# Altium project gateway.PrjPcb
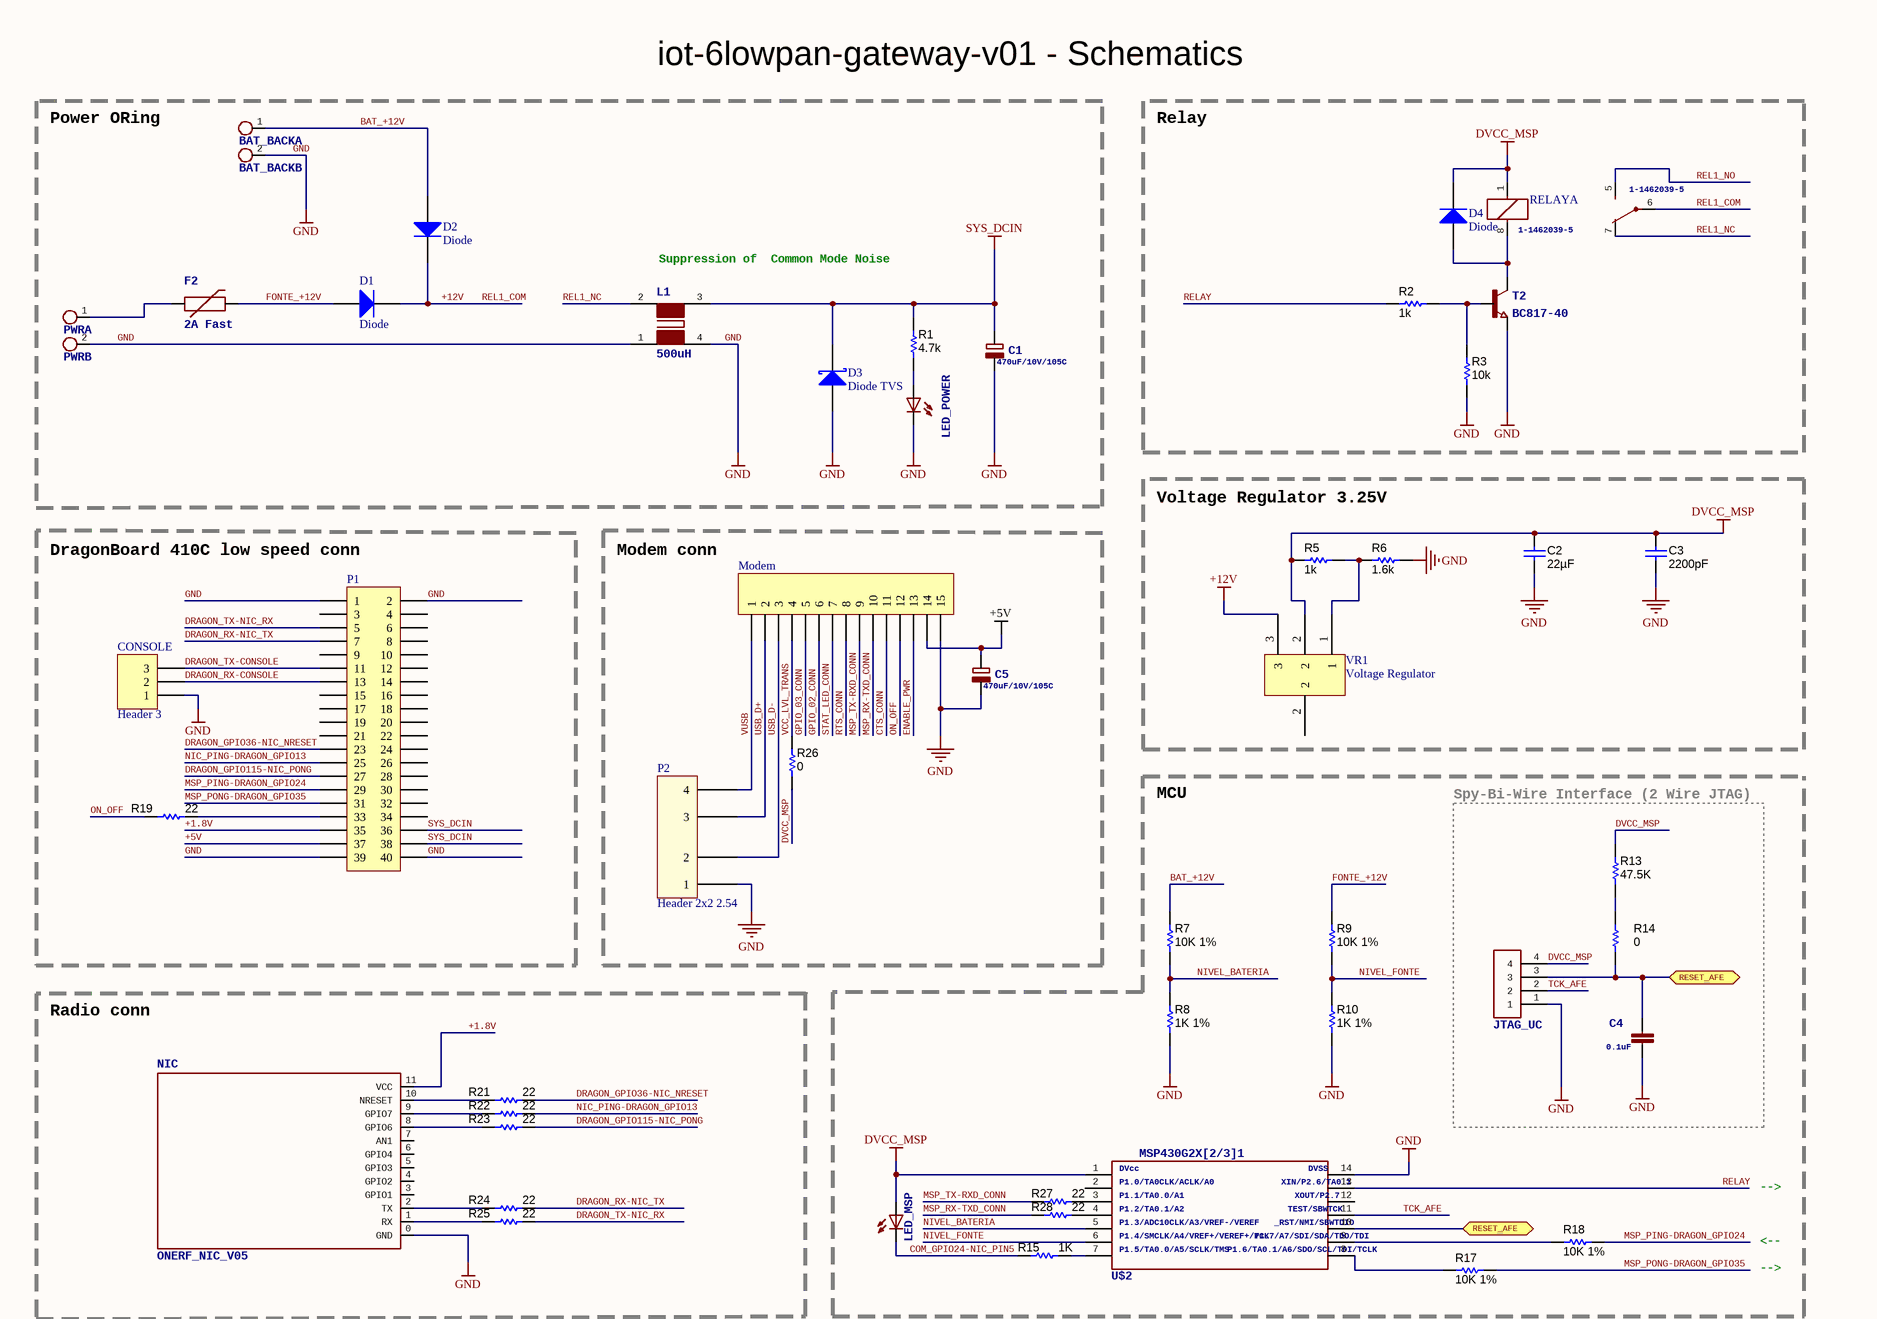
[diagram p0: gateway.SchDoc, top]
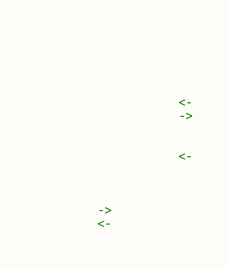
[diagram p1: gateway.SchDoc, bottom]
1 sheet, 48 parts. Net scope: flat (ports and power ports of the same name join across sheets).
Board file: gateway.PcbDoc

## Sheet gateway.SchDoc: oneRF_Base_COM_v04
size A3; Date: 2017-06-13 2:38:07 PM; SheetNumber: 1; PageSetup: Record=PageOptions|CenterHorizontal=True|CenterVertical=True|PrintScale=0.70|XCorrection=1.00|YCorrection=1.00|PrintKind=2|BorderSize=5000000|LeftOffset=0|BottomOffset=0|Orientation=2|PaperLength=1000|PaperWidth=1000|Scale=100|PaperSource=7|PrintQuality=-3|MediaType=1|DitherType=10|PrintScaleMode=0|PaperKind=A4|PaperIndex=9

### Parts
BAT_BACK  MKDSN1,5/2-5,08  [MKDSN1,5/2-5,08]  (value not drawn)  (parts A,B of 2)
C1  470uF/10V/105C  [E2,5-6,3]
C2  ValueDisplayed: 22µF  [0805_HV]  (hidden comment: C2012X5R1C226K125AC)
C3  ValueDisplayed: 2200pF  [0603]  (hidden comment: CL10B222KB8SFNC)
C4  0.1uF  [0603]
C5  470uF/10V/105C  [E2,5-6,3]
CONSOLE  Header 3  [HDR1X3]
D1  Diode  [SOD-80]
D2  Diode  [SOD-80]
D3  Diode TVS  [SMB]
D4  Diode  [SOD-80]
F2  2A Fast  [C1206]
JTAG_UC  CONECTOR_1X042.54MM  [HDR1X4]  (value not drawn)
L1  500uH  [WE-SL2_74422...]
LED_MSP  LED/WHITE/0603  [LED0603]  (value not drawn)
LED_POWER  LED/Red/0603  [LED0603]  (value not drawn)
Modem  oneRF_Modem_v01  [oneRF_Modem_v01]  (value not drawn)
NIC  ONERF_NIC_V05  [ONERF_NIC_V05]
P1  Header 20X2  [HDR2X20]  (value not drawn)
P2  Header 2x2 2.54  [HEADER2x2(2.54)]
PWR  MKDSN1,5/2-5,08  [MKDSN1,5/2-5,08]  (value not drawn)  (parts A,B of 2)
R1  value 4.7k  [0603]  (hidden comment: CRCW06031K00FKEA)
R2  value 1k  [0603]  (hidden comment: CRCW06031K00FKEA)
R3  value 10k  [0603]  (hidden comment: CRCW06031K00FKEA)
R5  value 1k  [0603]  (hidden comment: CRCW06031K00FKEA)
R6  value 1.6k  [0603]  (hidden comment: RC0603FR-071K6L)
R7  value 10K 1%  [0603]  (hidden comment: CRCW06031K00FKEA)
R8  value 1K 1%  [0603]  (hidden comment: CRCW06031K00FKEA)
R9  value 10K 1%  [0603]  (hidden comment: CRCW06031K00FKEA)
R10  value 1K 1%  [0603]  (hidden comment: CRCW06031K00FKEA)
R13  value 47.5K  [0603]  (hidden comment: CRCW06031K00FKEA)
R14  value 0  [0603]  (hidden comment: CRCW06031K00FKEA)
R15  value 1K  [0603]  (hidden comment: CRCW06031K00FKEA)
R17  value 10K 1%  [0603]  (hidden comment: CRCW06031K00FKEA)
R18  value 10K 1%  [0603]  (hidden comment: CRCW06031K00FKEA)
R19  value 22  [0603]  (hidden comment: CRCW06031K00FKEA)
R21  value 22  [0603]  (hidden comment: CRCW06031K00FKEA)
R22  value 22  [0603]  (hidden comment: CRCW06031K00FKEA)
R23  value 22  [0603]  (hidden comment: CRCW06031K00FKEA)
R24  value 22  [0603]  (hidden comment: CRCW06031K00FKEA)
R25  value 22  [0603]  (hidden comment: CRCW06031K00FKEA)
R26  value 0  [0603]  (hidden comment: CRCW06031K00FKEA)
R27  value 22  [0603]  (hidden comment: CRCW06031K00FKEA)
R28  value 22  [0603]  (hidden comment: CRCW06031K00FKEA)
RELAY  1-1462039-5  [1-1462039-5]  (parts A,B of 2)
T2  BC817-40  [SOT23_N]
U$2  MSP430G2231  [PW014_N]  (value not drawn)
VR1  Voltage Regulator  [SOT223]

### Blocks framed on the sheet
Power ORing: BAT_BACK C1 D1-D3 F2 L1 LED_POWER PWR R1
Relay: D4 R2 R3 RELAY T2
Voltage Regulator 3.25V: C2 C3 R5 R6 VR1
DragonBoard 410C low speed conn: CONSOLE P1 R19
Modem conn: C5 Modem P2 R26
MCU: LED_MSP R7-R10 R15 R17 R18 R27 R28 U$2
Spy-Bi-Wire Interface (2 Wire JTAG): C4 JTAG_UC R13 R14
Radio conn: NIC R21-R25

### Ports
RESET_AFE

### Nets
+5V: C5.+ Modem.14 P1.37
+12V: D1.2(K) D2.2(K) RELAY.6(COM) VR1.3  [also labelled REL1_COM]
DVCC_MSP: C2.1 C3.2 D4.2(K) JTAG_UC.4 LED_MSP.1(A) R5.1 R13.2 R26.1 RELAY.1 U$2.1 VR1.2
GND: BAT_BACK.2(KL) C1.- C2.2 C3.1 C4.2 C5.- CONSOLE.1 D3.1(A) JTAG_UC.1 L1.1 L1.4 LED_POWER.2(C) Modem.15 NIC.0(GND) P1.1 P1.2 P1.39 P1.40 P2.1 PWR.2(KL) R3.1 R6.2 R8.1 R10.1 T2.2(E) U$2.14
SYS_DCIN: C1.+ D3.2(K) L1.3 P1.36 P1.38 R1.2
+1.8V: NIC.11(VCC) P1.35
BAT_+12V: BAT_BACK.1(KL) D2.1(A) R7.2
COM_GPIO24-NIC_PIN5: LED_MSP.2(C) R15.2
CTS_CONN: Modem.11
DRAGON_GPIO36-NIC_NRESET: P1.23 R21.1
DRAGON_GPIO115-NIC_PONG: P1.27 R23.1
DRAGON_RX-CONSOLE: CONSOLE.2 P1.13
DRAGON_RX-NIC_TX: P1.7 R24.1
DRAGON_TX-CONSOLE: CONSOLE.3 P1.11
DRAGON_TX-NIC_RX: P1.5 R25.1
ENABLE_PWR: Modem.13
FONTE_+12V: D1.1(A) F2.2 R9.2
GPIO_02_CONN: Modem.6
GPIO_03_CONN: Modem.5
MSP_PING-DRAGON_GPIO24: P1.29 R18.1
MSP_PONG-DRAGON_GPIO35: P1.31 R17.1
MSP_RX-TXD_CONN: Modem.10 R28.2
MSP_TX-RXD_CONN: Modem.9 R27.2
NIC_PING-DRAGON_GPIO13: P1.25 R22.1
NIVEL_BATERIA: R7.1 R8.2 U$2.5
NIVEL_FONTE: R9.1 R10.2 U$2.6
ON_OFF: Modem.12 R19.2
REL1_NC: L1.2 RELAY.7(NC)
REL1_NO: RELAY.5(NO)
RELAY: R2.2 U$2.13
RTS_CONN: Modem.8
STAT_LED_CONN: Modem.7
TCK_AFE: JTAG_UC.2 U$2.11
USB_D+: Modem.2 P2.3
USB_D-: Modem.3 P2.2
VCC_LVL_TRANS: Modem.4 R26.2
VUSB: Modem.1 P2.4
NetC4_1: C4.1 JTAG_UC.3 R14.1 U$2.10 ; port RESET_AFE
NetD4_1: D4.1(A) RELAY.8 T2.3(C)
NetF2_1: F2.1 PWR.1(KL)
NetLED_POWER_1: LED_POWER.1(A) R1.1
NetNIC_1: NIC.1(RX) R25.2
NetNIC_2: NIC.2(TX) R24.2
NetNIC_8: NIC.8(GPIO6) R23.2
NetNIC_9: NIC.9(GPIO7) R22.2
NetNIC_10: NIC.10(NRESET) R21.2
NetP1_33: P1.33 R19.1
NetR2_1: R2.1 R3.2 T2.1(B)
NetR5_2: R5.2 R6.1 VR1.1
NetR13_1: R13.1 R14.2
NetR15_1: R15.1 U$2.7
NetR17_2: R17.2 U$2.8
NetR18_2: R18.2 U$2.9
NetR27_1: R27.1 U$2.3
NetR28_1: R28.1 U$2.4

Not connected (* = marked no-connect by the designer): NIC 3(GPIO1) 4(GPIO2) 5(GPIO3) 6(GPIO4) 7(AN1); P1 3 4 6 8 9 10 12 14 15 16 17 18 19 20 21 22 24 26 28 30 32 34; U$2 2 12

### Notes on the sheet
- iot-6lowpan-gateway-v01 - Schematics
- (near L1) Suppression of
  Common Mode Noise
- -->
- <--
- <-
- ->

### Library data of the parts
BAT_BACK PWR = MKDSN1,5/2-5,08: MKDSN 1,5/ 2-5,08 Printklemme   Nennstrom: 13,5 A Nennspannung: 250 V Rastermaß: 5,08 mm Polzahl: 2 Anschlussart: Schraubanschluss Montage: Löten Anschlussrichtung Leiter/Platine: 0 ° Artikelnummer: 1729128 Source: http://eshop.phoenixcontact.com .. 1729128.pdf; DIGIKEY: ED2768-ND
C1 C5 = CPOL-EUE2.5-6.3: POLARIZED CAPACITOR, European symbol
C2 = C2012X5R1C226K125AC: CAP, CERM, 22 µF, 16 V, +/- 10%, X5R, 0805; Value: 22uF; Tolerance_%: 10; VDC_V: 16; Value2: 16V; TaMin_C: -55; TaMax_C: 85; PartNumber: C2012X5R1C226K125AC; Technology: Ceramic; TempCo: X5R
C3 = C1005X7R1H222K: CAP, CERM, 2200 pF, 50 V, +/- 10%, X7R, 0603; Polarized: N; CompType: Capacitor; Value: 2200pF; U/M: EA; Tolerance_%: 10; VDC_V: 50; Value2: 50V; TaMin_C: -55; TaMax_C: 125; SymbolVersion: 2008-07-09; PartNumber: CL10B222KB8SFNC; PackageReference: 0603; RoHS: Y; MountType: SMT; Technology: Ceramic; TempCo: X7R; Cap_Case: 0603; Published: 2008-06-19; Publisher: Texas Instruments; Supplier 1: Digi-Key
C4 = C-EUC0603_DWS: CAPACITOR, European symbol
CONSOLE = Header 3: Header, 3-Pin; LatestRevisionDate: 17-Jul-2002; LatestRevisionNote: Re-released for DXP Platform.; Publisher: Altium Limited
D1 D2 D4 = Diode: Diode, 100v, 1V, 200mA, -65º, 175º, SMT; PartNumber: FDLL4148_D87Z
D3 = D Schottky: Schottky Diode; Published: 8-Jun-2000; LatestRevisionDate: 17-Jul-2002; LatestRevisionNote: Re-released for DXP Platform.; PackageReference: SMB; Publisher: Altium Limited; PackageDescription: DO-214-AA/SMB; 2 C-Bend Leads; Body 5.3 x 3.6 mm, inc. leads (LxW); Code_JEDEC: DO-214-AA
F2 = PTCSMD-W: Resettable Fuse PTCResettable Fuse. Spark Fun Electronics SKU : COM-08357; DIGIKEY: 507-1881-1-ND
L1 = WE-SL2: SMD Common-Mode Choke for signal lines WE-SL2 For distortion-free removal of noise from transmitted electrical signals - Double current-compensated choke -- Current compensated choke for data and signal lines -- Power supply systems -- Filter for measurement signals; DIGIKEY: 732-1484-1-ND
LED_MSP = LED0603_WWS
LED_POWER = LED0603DWS
Modem = Header 15: CONN HEADER .100" SNGL STR 15POS; Manufacturer: Wurth Electronics Inc.; Manufacturer Part Number: 61301511121; Pitch - Mating: 0.100" (2.54mm); Style: Board to Board or Cable; Shrouding: Unshrouded; Number of Positions: 15; Number of Positions Loaded: All; Contact Length - Mating: 0.236" (6.00mm); Contact Length - Post: 0.118" (3.00mm); Overall Contact Length: 0.454" (11.54mm); Material Flammability Rating: UL94 V-0; Current Rating: 3A; Voltage Rating: 250V; Supplier 1: Digi-Key; RoHS: RoHS Compliant; Category: Connectors, Interconnects; Stock 1: 868; Pricing 1: 1=0.82, 10=0.697, 25=0.5812, 50=0.484, 100=0.44, 500=0.4 (USD); Packaging: Bulk; Part Status: Active; Connector Type: Header; Contact Type: Male Pin; Number of Rows: 1; Row Spacing - Mating: -; Mounting Type: Through Hole; Termination: Solder; Fastening Type: -; Insulation Height: 0.100" (2.54mm); Contact Shape: Square; Contact Finish - Mating: Gold; Contact Finish Thickness - Mating: -; Contact Finish - Post: -; Contact Material: Copper Alloy; Insulation Material: Polybutylene Terephthalate (PBT); Features: -; Operating Temperature: -40°C ~ 125°C; Ingress Protection: -; Insulation Color: Black; Mated Stacking Heights: -; Contact Finish Thickness - Post: -; Applications: -; ComponentLink1URL: http://katalog.we-online.de/em/datasheet/6130xx11121.pdf; ComponentLink1Description: http://katalog.we-online.de/em/datasheet/6130xx11121.pdf; Supplier Part Number 1: 732-5326-ND
P1 = Header 20X2: Header, 20-Pin, Dual row; LatestRevisionDate: 17-Jul-2002; LatestRevisionNote: Re-released for DXP Platform.; Publisher: Altium Limited
P2 = HEADER2x2(2.54)
R1-R3 R5 R7-R10 R13-R15 R17-R19 R21-R28 = Resistor: RES, 1kohm, 1%, 1/10W, 0603; PartNumber: CRCW06031K00FKEA
R6 = Resistor: RES, 1.6kohm, 1%, 1/10W, 0603; PartNumber: RC0603FR-071K6L
RELAY = 1-1462039-5: RELAY; DIGIKEY: Z2616-ND
T2 = NPN-TRANSISTOR_SOT23: NPN TRANSISTOR
U$2 = G2X[2/3]1---PW14: MSP430G2X[2/3]1 TSSOP (PW) 14 Pin Package  http://focus.ti.com/docs/prod/folders/print/msp430g2221.html  MSP430G2121, MSP430G2221, MSP430G2131; DIGIKEY: 296-31697-1-ND; MSP430G2X[2/3]1: MSP430G2X[2/3]1; DVcc: DVcc; P1.0/TA0CLK/ACLK/A0: P1.0/TA0CLK/ACLK/A0; P1.1/TA0.0/A1: P1.1/TA0.0/A1; P1.2/TA0.1/A2: P1.2/TA0.1/A2; P1.3/ADC10CLK/A3/VREF-/VEREF: P1.3/ADC10CLK/A3/VREF-/VEREF; P1.4/SMCLK/A4/VREF+/VEREF+/TCK: P1.4/SMCLK/A4/VREF+/VEREF+/TCK; P1.5/TA0.0/A5/SCLK/TMS: P1.5/TA0.0/A5/SCLK/TMS; P1.6/TA0.1/A6/SDO/SCL/TDI/TCLK: P1.6/TA0.1/A6/SDO/SCL/TDI/TCLK; P1.7/A7/SDI/SDA/TDO/TDI: P1.7/A7/SDI/SDA/TDO/TDI; _RST/NMI/SBWTDIO: _RST/NMI/SBWTDIO; TEST/SBWTCK: TEST/SBWTCK; XOUT/P2.7: XOUT/P2.7; XIN/P2.6/TA0.1: XIN/P2.6/TA0.1; DVSS: DVSS
VR1 = Voltage Regulator: PartNumber: AZ1117H-ADJTRE1